# EAGLE design Mainboard (EAGLE 6.3)

## Sheet 1 of 2
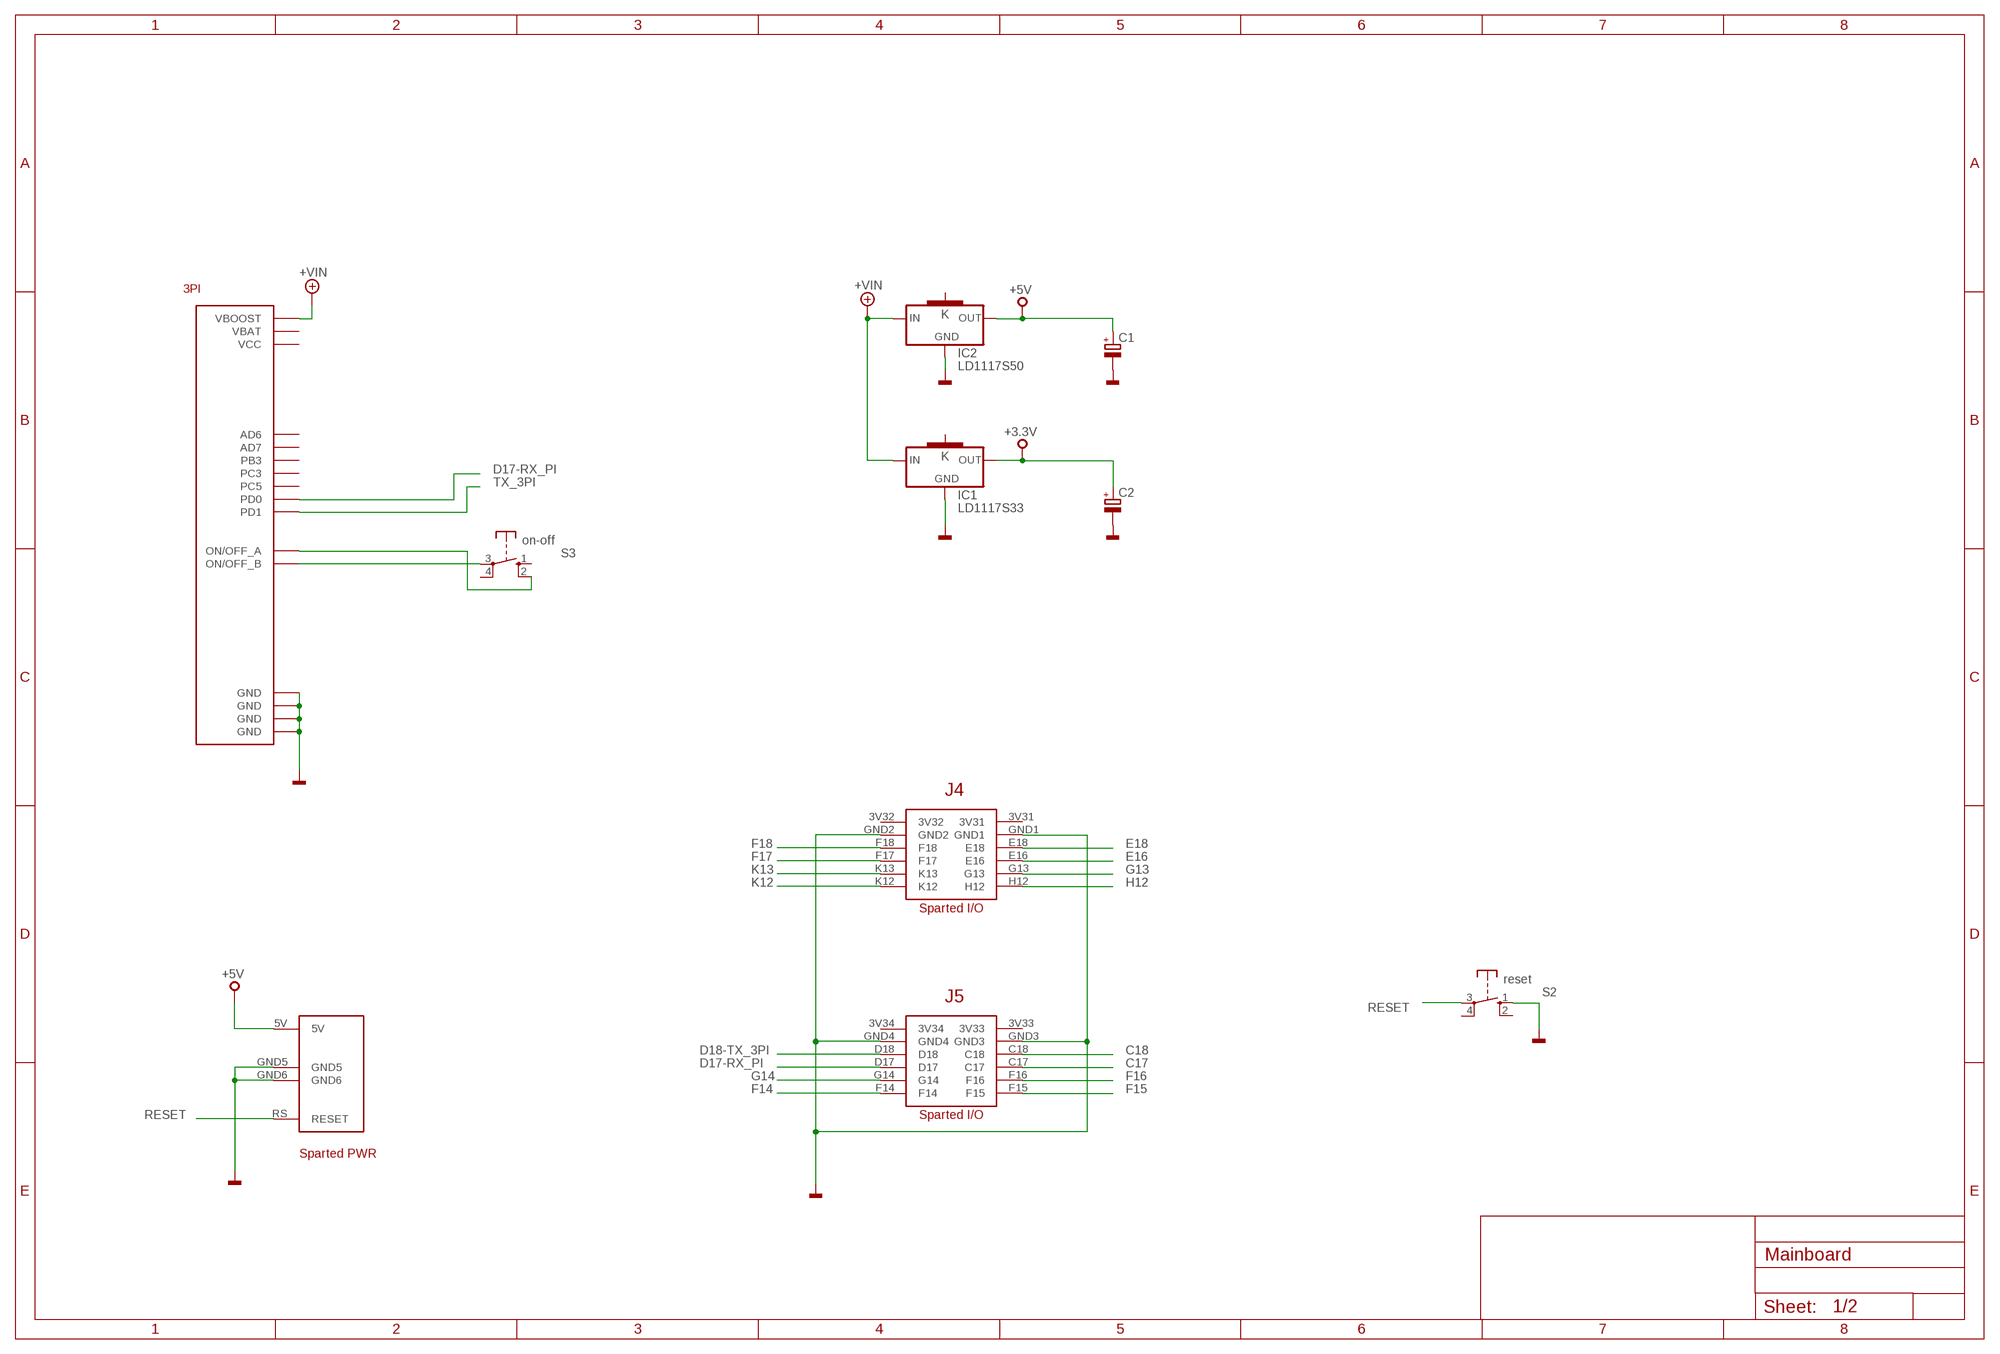
[diagram p0: schematic, sheet 1]

### Parts
C1  CPOL-EUE2.5-5  [E2,5-5]
C2  CPOL-EUE2.5-5  [E2,5-5]
IC1  LD1117S33  [SOT223]
IC2  LD1117S50  [SOT223]
S2  reset  DT6  [DT6]
S3  on-off  DT6  [DT6]
U$1  M3PI-NO-LCD  [M3PI-NO-LCD]
U$4  LX9  [LX9]

### Nets
+3,3V: C2.+ IC1.2(OUT) ; supply symbol labelled +3.3V
+5V: C1.+ IC2.2(OUT) U$4.5V ; also sheet 2
+VIN: IC1.3(IN) IC2.3(IN) U$1.VBOOST
C17: U$4.C17 ; also sheet 2
C18: U$4.C18 ; also sheet 2
D17-RX_PI: U$1.PD0 U$4.D17 ; also sheet 2
D18-TX_3PI: U$4.D18 ; also sheet 2
E16: U$4.E16 ; also sheet 2
E18: U$4.E18 ; also sheet 2
F14: U$4.F14 ; also sheet 2
F15: U$4.F15 ; also sheet 2
F16: U$4.F16 ; also sheet 2
F17: U$4.F17 ; also sheet 2
F18: U$4.F18 ; also sheet 2
G13: U$4.G13 ; also sheet 2
G14: U$4.G14 ; also sheet 2
GND: C1.- C2.- IC1.1(GND) IC2.1(GND) S2.1(S) U$1.GND@1(GND) U$1.GND@2(GND) U$1.GND@3(GND) U$1.GND@4(GND) U$4.GND1 U$4.GND2 U$4.GND3 U$4.GND4 U$4.GND5 U$4.GND6 ; also sheet 2
H12: U$4.H12 ; also sheet 2
K12: U$4.K12 ; also sheet 2
K13: U$4.K13 ; also sheet 2
N$3: S3.3(P) U$1.ON/OFF_B
N$4: S3.2(S) U$1.ON/OFF_A
RESET: S2.3(P) U$4.RS(RESET)
TX_3PI: U$1.PD1 ; also sheet 2
Unconnected: IC1.4(K) IC2.4(K) S2.2(S) S2.4(P) S3.1(S) S3.4(P) U$1.AD6 U$1.AD7 U$1.PB3 U$1.PC3 U$1.PC5 U$1.VBAT U$1.VCC U$4.3V31 U$4.3V32 U$4.3V33 U$4.3V34

### Notes on the sheet
- Sparted I/O
- Sparted I/O
- Sparted PWR

## Sheet 2 of 2
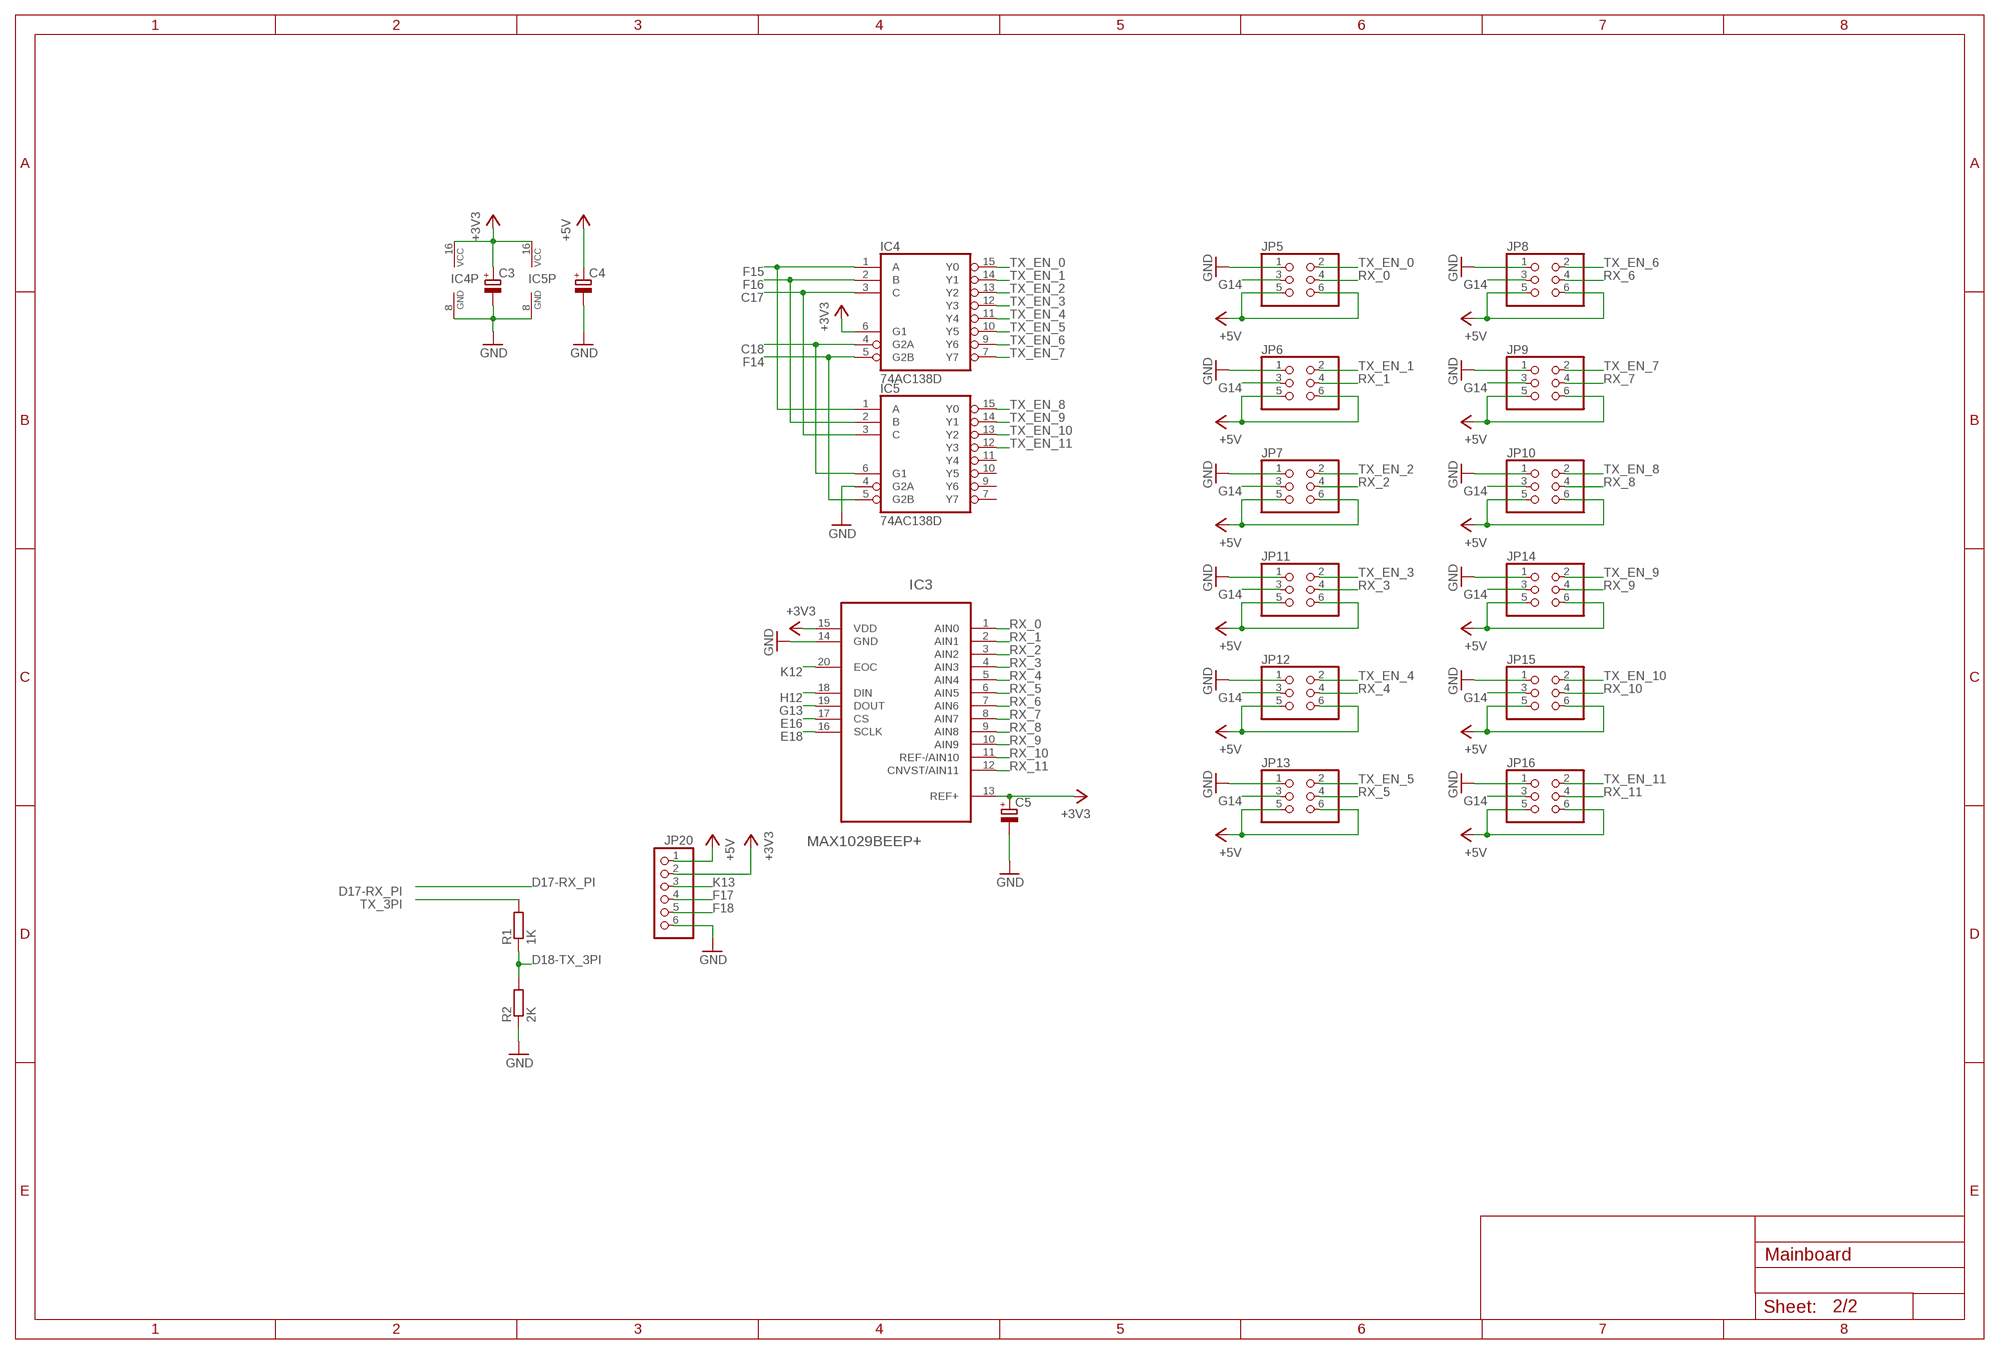
[diagram p1: schematic, sheet 2]

### Parts
C3  CPOL-EUE2-5  [E2-5]
C4  CPOL-EUE2-5  [E2-5]
C5  CPOL-EUE2-5  [E2-5]
IC3  MAX1029BEEP+  [SOP64P600X165-20N]
IC4  74AC138D  [SO16]
IC5  74AC138D  [SO16]
JP5  PINHD-2X3  [2X03]
JP6  PINHD-2X3/90  [2X03/90]
JP7  PINHD-2X3/90  [2X03/90]
JP8  PINHD-2X3/90  [2X03/90]
JP9  PINHD-2X3  [2X03]
JP10  PINHD-2X3/90  [2X03/90]
JP11  PINHD-2X3/90  [2X03/90]
JP12  PINHD-2X3/90  [2X03/90]
JP13  PINHD-2X3/90  [2X03/90]
JP14  PINHD-2X3/90  [2X03/90]
JP15  PINHD-2X3/90  [2X03/90]
JP16  PINHD-2X3/90  [2X03/90]
JP20  PINHD-1X6  [1X06]
R1  1K  R-EU_R0805  [R0805]
R2  2K  R-EU_R0805  [R0805]

### Nets
+3V3: C3.+ C5.+ IC3.13(REF+) IC3.15(VDD) IC4.6(G1) IC4.16(VCC) IC5.16(VCC) JP20.2
+5V: C4.+ JP5.5 JP5.6 JP6.5 JP6.6 JP7.5 JP7.6 JP8.5 JP8.6 JP9.5 JP9.6 JP10.5 JP10.6 JP11.5 JP11.6 JP12.5 JP12.6 JP13.5 JP13.6 JP14.5 JP14.6 JP15.5 JP15.6 JP16.5 JP16.6 JP20.1 ; also sheet 1
C17: IC4.3(C) IC5.3(C) ; also sheet 1
C18: IC4.4(G2A) IC5.6(G1) ; also sheet 1
D18-TX_3PI: R1.1 R2.2 ; also sheet 1
E16: IC3.17(CS) ; also sheet 1
E18: IC3.16(SCLK) ; also sheet 1
F14: IC4.5(G2B) IC5.5(G2B) ; also sheet 1
F15: IC4.1(A) IC5.1(A) ; also sheet 1
F16: IC4.2(B) IC5.2(B) ; also sheet 1
F17: JP20.4 ; also sheet 1
F18: JP20.5 ; also sheet 1
G13: IC3.19(DOUT) ; also sheet 1
G14: JP5.3 JP6.3 JP7.3 JP8.3 JP9.3 JP10.3 JP11.3 JP12.3 JP13.3 JP14.3 JP15.3 JP16.3 ; also sheet 1
GND: C3.- C4.- C5.- IC3.14(GND) IC4.8(GND) IC5.4(G2A) IC5.8(GND) JP5.1 JP6.1 JP7.1 JP8.1 JP9.1 JP10.1 JP11.1 JP12.1 JP13.1 JP14.1 JP15.1 JP16.1 JP20.6 R2.1 ; also sheet 1
H12: IC3.18(DIN) ; also sheet 1
K12: IC3.20(EOC) ; also sheet 1
K13: JP20.3 ; also sheet 1
RX_0: IC3.1(AIN0) JP5.4
RX_1: IC3.2(AIN1) JP6.4
RX_2: IC3.3(AIN2) JP7.4
RX_3: IC3.4(AIN3) JP11.4
RX_4: IC3.5(AIN4) JP12.4
RX_5: IC3.6(AIN5) JP13.4
RX_6: IC3.7(AIN6) JP8.4
RX_7: IC3.8(AIN7) JP9.4
RX_8: IC3.9(AIN8) JP10.4
RX_9: IC3.10(AIN9) JP14.4
RX_10: IC3.11(REF-/AIN10) JP15.4
RX_11: IC3.12(CNVST/AIN11) JP16.4
TX_3PI: R1.2 ; also sheet 1
TX_EN_0: IC4.15(Y0) JP5.2
TX_EN_1: IC4.14(Y1) JP6.2
TX_EN_2: IC4.13(Y2) JP7.2
TX_EN_3: IC4.12(Y3) JP11.2
TX_EN_4: IC4.11(Y4) JP12.2
TX_EN_5: IC4.10(Y5) JP13.2
TX_EN_6: IC4.9(Y6) JP8.2
TX_EN_7: IC4.7(Y7) JP9.2
TX_EN_8: IC5.15(Y0) JP10.2
TX_EN_9: IC5.14(Y1) JP14.2
TX_EN_10: IC5.13(Y2) JP15.2
TX_EN_11: IC5.12(Y3) JP16.2
Unconnected: IC5.7(Y7) IC5.9(Y6) IC5.10(Y5) IC5.11(Y4)

## Library data of the parts
C1-C5 = rcl:CPOL-EU: POLARIZED CAPACITOR, European symbol
IC1 = mbed-ics:LD1117S33: VOLTAGE REGULATOR SMD 3,3V
IC2 = mbed-ics:LD1117S50: VOLTAGE REGULATOR SMD 5V
IC3 = Ultrasound:MAX1029BEEP+; OC_FARNELL: 1714967
IC4 IC5 = 74xx-eu:74*138: 3-line to 8-line DECODER/DEMULTIPLEXER; OC_FARNELL: 1201320
JP5-JP16 = pinhead:PINHD-2X3: PIN HEADER
JP20 = pinhead:PINHD-1X6: PIN HEADER
R1 R2 = rcl:R-EU_: RESISTOR, European symbol
S2 S3 = switch-misc:DT: ITT SWITCH
U$1 = m3pi:M3PI-NO-LCD
U$4 = sparten6-lx9:LX9

## Board
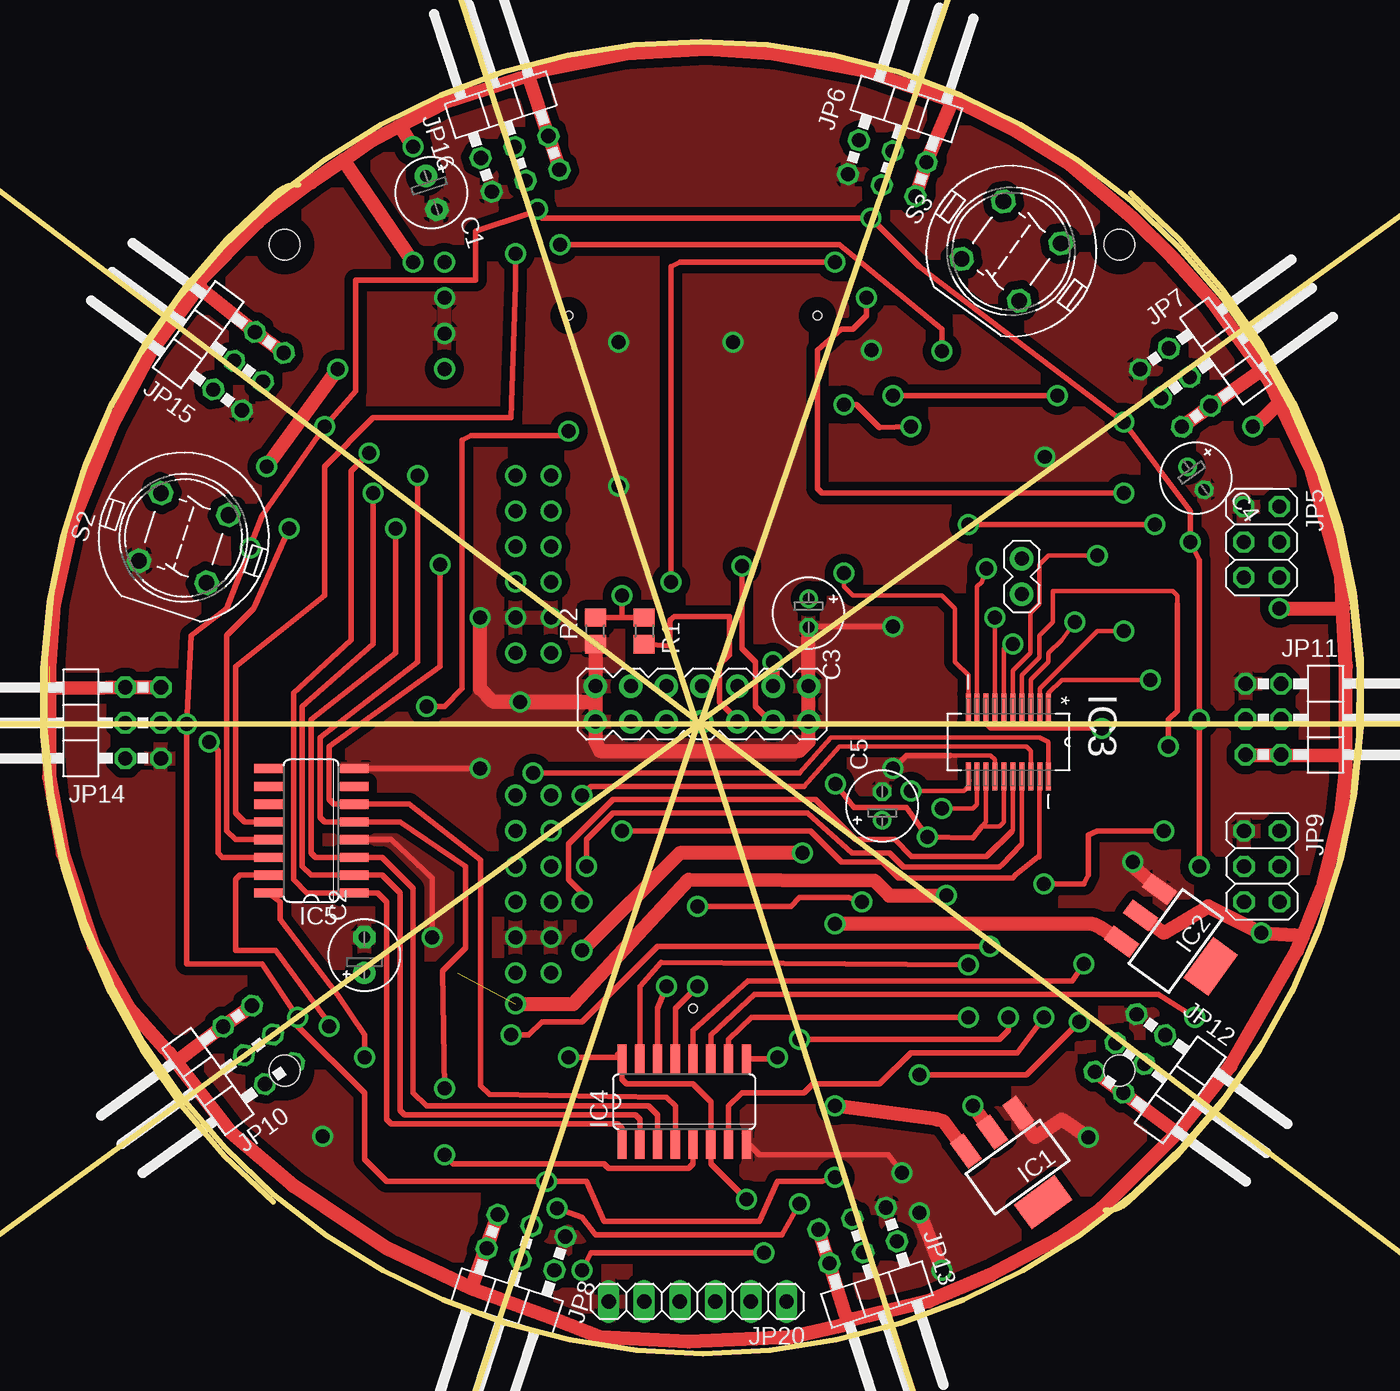
[diagram p2: board, top side]
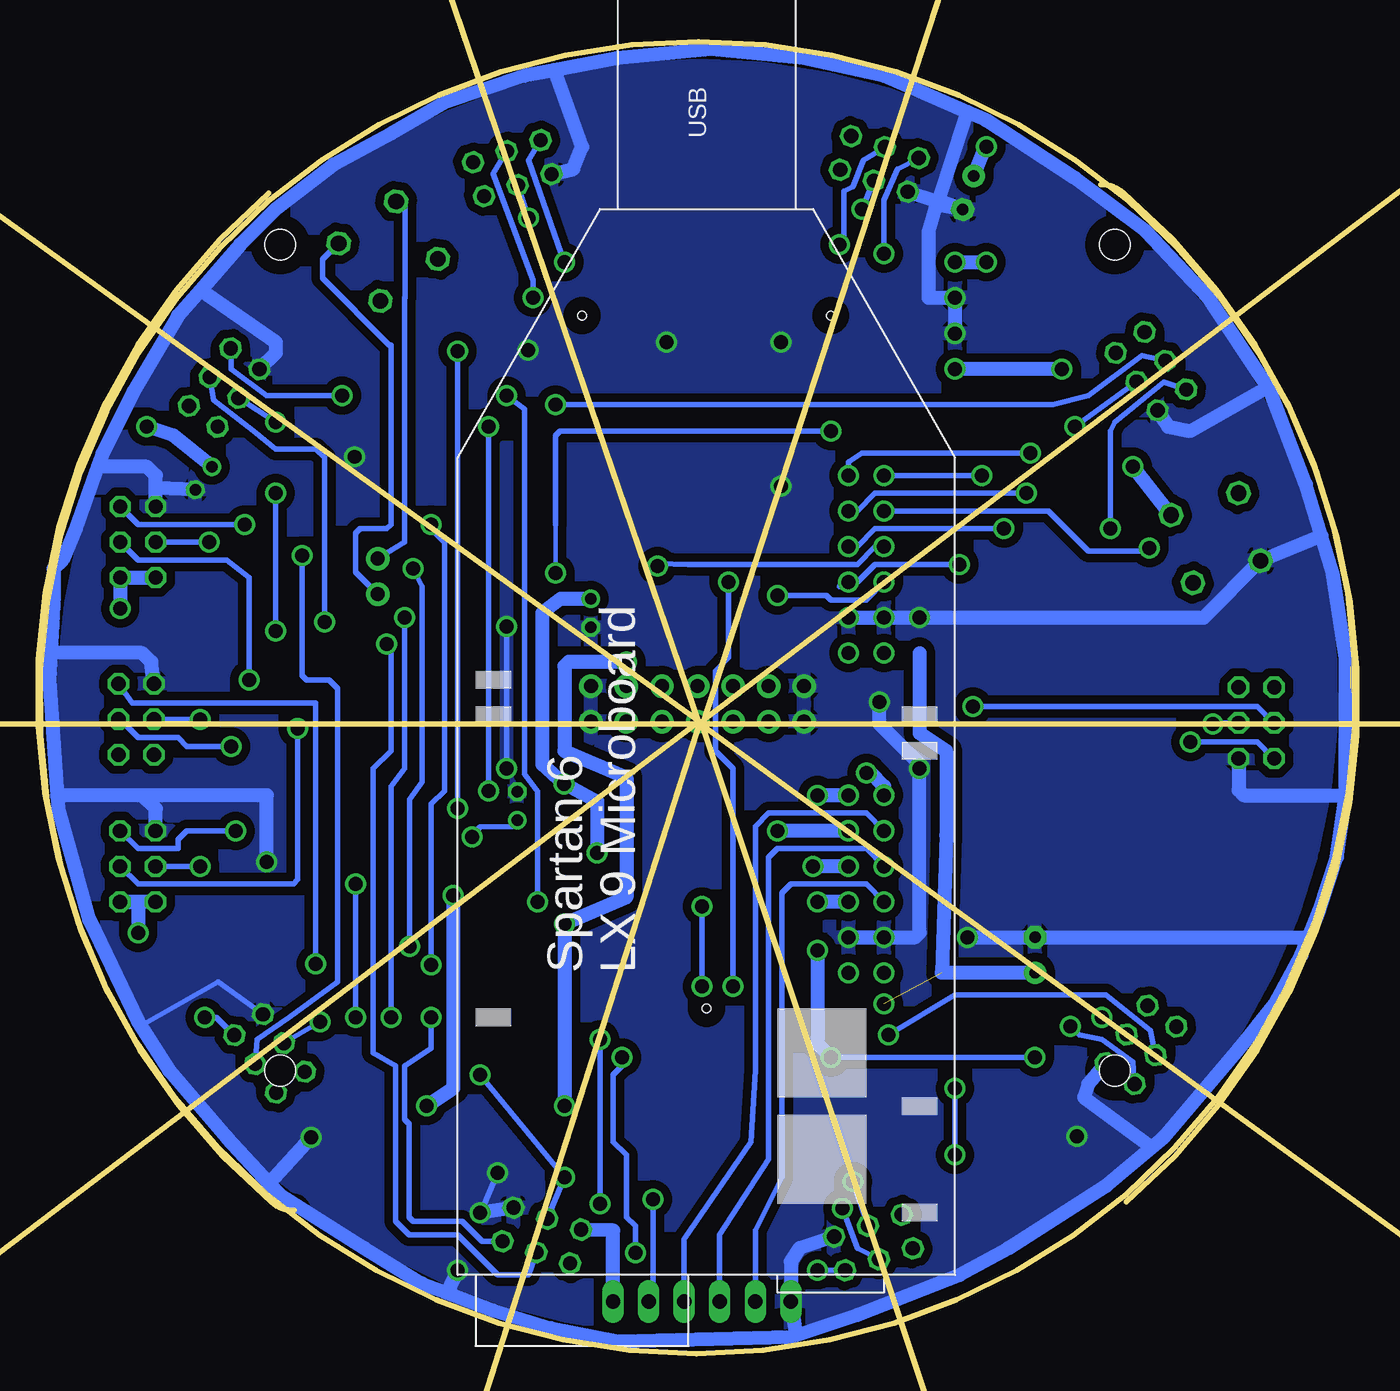
[diagram p3: board, bottom side, seen from below]

Size 94.28 x 93.8 mm. Coordinates in mm from the lower left corner, seen from the top.
Copper layers (1*16): Top 0.035mm / dielectric 1.5mm / Bottom 0.035mm
Design rules "default": minimum track width 10mil, minimum drill 24mil, track to track 8mil, track to pad 8mil, pad to pad 8mil, via to via 8mil, smd to smd 8mil, copper to edge 40mil, drill to drill 8mil, minimum pad ring 10mil, minimum via ring 8mil, stop-mask expansion 4mil, vias tented up to drill 0mil, thermal gap 10mil
Milling: 9 lines

### Footprints (pad centres in the part's own frame; a part is rotated, then mirrored left to right if it is on the bottom)
E2,5-5 = drill 0.813 pad 1.6: + -1.27,0 | drill 0.813 pad 1.6 octagon: - 1.27,0
E2-5 = drill 0.813 pad 1.27: + -1.016,0 | drill 0.813 pad 1.27 octagon: - 1.016,0
SOT223 = smd 1.219 x 2.235: 1 -2.311,-3.099; 2 0,-3.099; 3 2.311,-3.099 | smd 3.6 x 2.2: 4 0,3.099
SOP64P600X165-20N = smd 1.981 x 0.356: 1 -2.464,2.87; 2 -2.464,2.235; 3 -2.464,1.6; 4 -2.464,0.965; 5 -2.464,0.33; 6 -2.464,-0.33; 7 -2.464,-0.965; 8 -2.464,-1.6; 9 -2.464,-2.235; 10 -2.464,-2.87; 11 2.464,-2.87; 12 2.464,-2.235; 13 2.464,-1.6; 14 2.464,-0.965; 15 2.464,-0.33; 16 2.464,0.33; 17 2.464,0.965; 18 2.464,1.6; 19 2.464,2.235; 20 2.464,2.87
SO16 = smd 0.66 x 2.032: 1 -4.445,-3.073; 2 -3.175,-3.073; 3 -1.905,-3.073; 4 -0.635,-3.073; 5 0.635,-3.073; 6 1.905,-3.073; 7 3.175,-3.073; 8 4.445,-3.073; 9 4.445,3.073; 10 3.175,3.073; 11 1.905,3.073; 12 0.635,3.073; 13 -0.635,3.073; 14 -1.905,3.073; 15 -3.175,3.073; 16 -4.445,3.073
2X03 = drill 1.016 octagon: 1 -2.54,-1.27; 2 -2.54,1.27; 3 0,-1.27; 4 0,1.27; 5 2.54,-1.27; 6 2.54,1.27
2X03/90 = drill 1.016 octagon: 1 -2.54,-6.35; 2 -2.54,-3.81; 3 0,-6.35; 4 0,-3.81; 5 2.54,-6.35; 6 2.54,-3.81
1X06 = drill 1.016 long: 1 -6.35,0; 2 -3.81,0; 3 -1.27,0; 4 1.27,0; 5 3.81,0; 6 6.35,0
R0805 = smd 1.3 x 1.5: 1 -0.95,0; 2 0.95,0
DT6 = drill 1.118 octagon: 1 -2.54,2.54; 2 2.54,2.54; 3 2.54,-2.54; 4 -2.54,-2.54
M3PI-NO-LCD = drill 1 pad 1.676: AD6 0,-16.97; AD7 -2.54,-16.97; GND@1 -7.62,-14.43; GND@2 -7.62,-16.97; GND@3 7.62,-14.43; GND@4 7.62,-16.97; ON/OFF_A 22.86,-5.31; ON/OFF_B 22.86,-7.85; PB3 -5.08,-14.43; PC3 -2.54,-14.43; PC5 -5.08,-16.97; PD0 5.08,-16.97; PD1 2.54,-16.97; VBAT 2.54,-14.43; VBOOST 5.08,-14.43; VCC 0,-14.43 | hole 2.2: -29.845,-41.91; 29.845,-41.91; 29.845,17.145; -29.845,17.145
LX9 = drill 1: 3V31 21.59,-10.16; 3V32 21.59,-12.7; 3V33 44.45,-10.16; 3V34 44.45,-12.7; C17 52.07,-10.16; C18 49.53,-10.16; D17 52.07,-12.7; D18 49.53,-12.7; E16 29.21,-10.16; E18 26.67,-10.16; F14 57.15,-12.7; F15 57.15,-10.16; F16 54.61,-10.16; F17 29.21,-12.7; F18 26.67,-12.7; G13 31.75,-10.16; G14 54.61,-12.7; GND1 24.13,-10.16; GND2 24.13,-12.7; GND3 46.99,-10.16; GND4 46.99,-12.7; H12 34.29,-10.16; K12 34.29,-12.7; K13 31.75,-12.7 | drill 1 pad 1.27: 5V 72.39,-17.78; GND5 69.85,-17.78; GND6 67.31,-17.78; RS 64.77,-17.78 | hole 0.6: 19.05,0; 68.58,8.89; 68.58,-8.89

### Placement (x,y rotation side)
C1  27.79,83 288 top
C2  23.01,28.49 90 top
C3  54.76,52.93 270 top
C4  82.45,62.59 306 top
C5  60.03,39.16 90 top
IC1  69.7,13.32 216 top
IC2  81.01,29.5 234 top
IC3  69.05,43.73 270 top
IC4  45.87,18.01 0 top
IC5  19.2,37.38 90 top
JP5  87.15,58.01 270 top
JP6  61.96,89.58 342 top
JP7  85.1,72.05 306 top
JP8  32.99,3.11 162 top
JP9  87.16,34.83 270 top
JP10  11.32,19.08 126 top
JP11  92.36,45.35 270 top
JP12  81.85,18.47 234 top
JP13  59.84,3.61 198 top
JP14  2.1,45.09 90 top
JP15  10.61,73.22 54 top
JP16  32.57,89.89 18 top
JP20  46.82,3.72 180 top
R1  43.01,51.66 270 top
R2  39.52,51.66 90 top
S2  10.09,58.32 72 top
S3  69.25,78.82 54 top
U$1  47.14,62.14 0 top
U$4  46.51,5.63 90 bottom

### Tracks (layer width: path | path; a pad name or v marks a point on that pad's centre or on a via)
+3,3V  (via drill 1 pad 1.27)  (1 unrouted)
  Top 1.016: IC1.2 v66.51,17.69 | v64.6,32.74 60.54,32.74 59.46,33.82 46.19,33.88 37.93,24.99 v33.81,24.99
  Bottom 1.016: v66.51,17.69 64.6,18.96 v64.6,32.74 | C2.+ 29.68,27.22 29.36,37.06 29.36,43.09 31.27,44.36 31.27,50.08
+3V3  (via drill 1, 1 pad 1.27)
  Top 0.305: IC3.15 68.72,38 68.41,37.69 67.14,37.69 67.45,38 IC3.13
  Top 0.406: IC5.16 16.98,32.3 16.98,31.03 21.11,25.63 23.01,22.77 v23.01,21.19 | 41.32,21.19 IC4.16 | v37.62,21.19 41.11,21.19 41.11,21.4 IC4.16 | IC4.16 41.43,19.6 41.74,19.28 46.51,19.28 47.78,18.01 IC4.6 47.78,13.56 v50.32,11.03 | 67.14,37.69 66.51,36.87 v63.27,36.93 61.75,39.03 58,39.03 v56.69,40.72
  Top 1.016: v54.32,35.79 45.55,35.79 v38.57,28.8
  Bottom 0.406: v23.01,21.19 v37.62,21.19 | v50.32,11.03 50.32,4.04 JP20.2 | v56.69,40.72 57.16,41.29 56.55,40.68 | C5.+ 60.03,38.08 60.41,37.69 62.7,37.63 63.27,37.06 v63.27,36.93
  Bottom 1.016: C3.+ 56.92,53.95 58.25,52.94 58.25,42.14 v56.69,40.72 56.55,40.68 54.32,39.47 v54.32,35.79 | v38.57,28.8 38.57,22.14 v37.62,21.19
+5V  (via drill 1 pad 1.27)  (1 unrouted)
  Top 1.016: JP8.6 JP8.5 30.63,4.68 | 30.63,4.68 24.6,7.53 17.93,11.98 13.49,15.79 9.55,20.84 | 9.55,20.84 9.04,21.5 | 9.55,20.84 JP10.6 JP10.5 | 30.63,4.68 36.66,2.45 39.84,1.18 46.19,0.87 53.49,1.18 57.62,2.14 57.56,2.33 | 57.56,2.33 JP13.6 JP13.5 | 81.11,15.79 JP12.6 JP12.5 81.11,15.79 | 81.11,15.79 75.72,10.39 72.54,8.17 67.78,5.63 63.33,3.72 57.56,2.33 | 81.11,15.79 84.92,20.55 89.69,28.8 90.12,29.9 | 90.12,29.9 91.02,32.14 91.44,33.18 91.59,33.57 92.86,38.65 93.18,41.51 93.18,42.77 | 93.18,42.77 93.18,49.12 92.97,53.27 | JP11.5 JP11.6 93.18,42.77 | 92.97,53.27 92.86,55.47 90.64,63.41 88.45,68.03 | 88.45,68.03 87.78,69.44 87.15,70.31 | 87.15,70.31 83.65,75.16 80.8,78.33 77.94,81.19 73.49,85 69.37,87.54 66.19,89.13 65.06,89.52 | JP7.5 JP7.6 87.15,70.31 | 65.06,89.52 58.89,91.67 52.22,92.94 47.46,93.26 41.74,92.94 35.39,91.67 34.76,91.35 | JP16.5 JP16.6 34.76,91.35 | 34.76,91.35 28.73,89.45 25.57,87.78 | 25.57,87.78 23.33,86.59 21.51,85.33 | 21.51,85.33 19.2,83.73 15.39,80.88 10.95,76.43 | 10.95,76.43 JP15.6 JP15.5 | v26.5,86.27 25.57,87.78 | JP14.6 JP14.5 0.47,47.54 | 11.26,76.43 11.15,76.28 | 11.15,76.28 7.77,71.67 4.91,66.27 2.06,59.29 0.79,53.57 0.47,49.12 0.47,41.19 1.42,35.79 3.64,29.12 6.18,24.68 8.72,21.82 | 10.95,76.43 11.15,76.28 | 90.12,29.9 v87.15,30.08 83.34,31.98 80.16,30.08 IC2.2 | v88.42,53.25 92.97,53.27 | JP6.5 JP6.6 65.06,89.52 | v26.5,78.02 21.51,85.33 | v86.51,66.27 87.33,66.91 88.45,68.03
  Bottom 1.016: JP20.1 53.17,8.8 JP13.5 | JP9.5 JP9.6 87.15,32.3 v87.15,30.08 | JP5.5 JP5.6 v88.42,53.25 | C1.+ 26.82,85.64 v26.5,86.27 | U$4.5V v26.5,78.02 | C4.+ 84.6,65.63 v86.51,66.27
+VIN  (via drill 1 pad 1.27)
  Top 1.016: U$1.VBOOST v52.22,49.44 | IC1.3 64.43,16.6 63.97,16.74 v56.67,17.69 | IC2.3 75.72,30.39 75.08,30.71 v56.67,30.71
  Bottom 1.016: v52.22,49.44 56.35,49.44 56.67,49.12 56.67,43.09 52.22,41.19 52.22,32.62 v56.67,30.71 v56.67,17.69
C17  (via drill 1 pad 1.27)
  Top 0.406: IC4.3 43.97,17.06 43.33,17.69 27.46,17.69 26.5,18.65 26.5,33.25 24.28,35.47 IC5.3 19.52,35.47 19.2,35.79 19.2,45.32 25.23,50.08 v25.23,58.97
  Bottom 0.406: v25.23,58.97 34.44,58.97 35.71,57.7 U$4.C17
C18  (via drill 1 pad 1.27)
  Top 0.406: IC4.4 45.24,17.69 44.6,18.33 31.96,18.52 31.33,19.15 31.33,35.28 26.19,39.28 IC5.6 20.79,39.28 20.47,39.6 20.47,43.41 28.41,49.12 v28.41,56.43
  Bottom 0.406: v28.41,56.43 34.44,56.43 35.71,55.16 U$4.C18 | U$4.C18 36.66,55.16 36.98,54.84 36.66,54.84 U$4.C18
D17-RX_PI  (via drill 1 pad 1.27)
  Top 0.406: U$1.PD0 52.05,45.17 50.95,46.27 50.95,49.44 50,50.4 v50,56.3
  Bottom 0.406: v50,56.3 50,56.49 47.78,56.43 35.71,56.43 34.44,57.7 U$4.D17
D18-TX_3PI  (via drill 1 pad 1.27)
  Top 0.406: R1.1 R2.2 41.42,52.62 41.43,52.62 v41.43,54.2
  Bottom 0.406: v41.43,54.2 37.93,54.2 37.62,53.89 35.08,53.89 U$4.D18
E16  (via drill 1 pad 1.27)
  Top 0.305: IC3.17 70.01,36.44 69.94,36.36
  Top 0.406: v38.89,34.84 38.89,36.74 40.79,38.65 54.7,38.65 57.87,35.79 60.54,35.79 61.55,34.77 68.41,34.77 68.6,34.96 69.94,36.36
  Bottom 1.016: U$4.E16 v38.89,34.84
E18  (via drill 1 pad 1.27)
  Top 0.305: IC3.16 69.38,37.39 69.3,37.31
  Top 0.406: v38.57,32.3 38.57,32.93 37.62,33.88 37.62,36.43 40.79,39.6 55.27,39.6 58.13,36.74 60.92,36.74 62.13,35.54 67.46,35.54 69.3,37.31
  Bottom 1.016: U$4.E18 v38.57,32.3
F14  (via drill 1 pad 1.27)
  Top 0.406: v28.73,18.96 28.6,27.34 30.25,29 30.25,34.84 25.55,38.01 IC5.5 20.15,38.01 19.84,38.33 19.84,44.05 26.82,49.44 v26.82,62.78 | v28.73,14.2 29.36,13.56 40.16,13.56 40.47,13.25 46.19,13.25 46.51,13.56 IC4.5
  Bottom 0.406: v28.73,18.96 v28.73,14.2 | v26.82,62.78 U$4.F14
F15  (via drill 1 pad 1.27)
  Top 0.406: IC4.1 41.43,16.1 41.11,16.42 24.92,16.42 24.6,16.74 24.6,32.3 23.96,32.93 IC5.1 18.88,32.93 17.93,33.88 17.93,47.22 22.06,51.03 22.06,63.09 v23.33,64.37
  Bottom 0.406: v23.33,64.37 35.39,64.37 36.35,63.73 U$4.F15
F16  (via drill 1 pad 1.27)
  Top 0.406: IC4.2 42.7,16.74 42.38,17.06 25.87,17.06 25.55,17.37 25.55,32.93 24.28,34.2 IC5.2 19.2,34.2 18.57,34.84 18.57,46.27 23.65,50.71 v23.65,61.51
  Bottom 0.406: v23.65,61.51 34.44,61.51 35.71,60.24 U$4.F16
F17
  Bottom 0.406: U$4.F17 35.08,36.11 41.43,36.11 42.06,35.47 42.06,13.88 45.55,8.48 JP20.4
F18
  Bottom 0.406: U$4.F18 35.08,33.57 40.47,33.57 41.11,32.93 41.11,12.61 43.01,8.8 JP20.5
G13  (via drill 1 pad 1.27)
  Top 0.305: 71.21,35.54 71.27,35.47 71.27,39.66 IC3.19
  Top 0.406: v41.43,37.38 54.89,37.38 57.11,35.15 60.03,35.15 61.17,34.01 69.37,34.01 69.56,34.2 71.21,35.54
  Bottom 1.016: U$4.G13 v41.43,37.38
G14  (via drill 1 pad 1.27)
  Top 0.406: 15.1,58.32 15.71,59.92 v20.15,66.27 22.38,68.81 22.38,76.75 30.95,76.75 30.95,80.24 34.76,81.51 v35.39,81.83 35.71,81.19 v59.21,81.19 62.7,77.7 v77.3,66.59 82.07,60.24 v82.07,58.01 82.7,56.75 v82.7,45.32 v82.7,34.84 | 15.1,58.32 v14.82,57.6 | v14.82,57.6 13.17,53.25 10.63,51.35 v10.31,45 10.31,27.85 15.71,27.85 v18.25,24.04 18.25,23.41 23.01,18.65 23.01,13.88 24.6,12.3 v36.03,12.3 38.89,12.3 40.16,9.44 51.27,9.44 52.54,12.3 55.71,12.3 v56.67,12.61 | v74.13,23.72 70.32,19.92 v62.7,19.92 | v14.82,57.6 14.82,58.05 15.1,58.32
  Bottom 0.406: JP14.3 10.22,45.09 v10.31,45 | JP15.3 v20.15,66.27 | JP16.3 v35.39,81.83 | JP6.3 v59.21,81.19 | JP9.3 v82.7,34.84 | JP11.3 v82.7,45.32 | JP5.3 v82.07,58.01 | JP12.3 v74.13,23.72 | JP8.3 v36.03,12.3 | JP13.3 v56.67,12.61 v62.7,19.92 | v18.25,24.04 JP10.3 | U$4.G14 22.06,60.24 19.2,57.38 15.04,57.38 v14.82,57.6 | JP7.3 78.26,67.22 v77.3,66.59 JP7.3
GND  (via drill 1 pad 1.27)
  Top 0.305: IC3.14 68.08,42.47 67.78,42.77 64.92,42.77
  Top 0.406: IC5.4 24.92,36.74 27.84,34.01 v27.84,29.76 | IC5.8 v31.27,41.82 | IC4.8 50.53,14.94 51.27,14.2 60.48,14.2 v61.43,12.93 | 64.92,42.77 61.75,42.77 v60.79,41.82 | v60.79,51.98 54.82,51.98 C3.-
  Top 1.016: 39.52,46.27 U$1.GND@2 39.52,43.73 39.84,43.09 54.13,43.09 54.76,43.73 U$1.GND@4 U$1.GND@3 C3.- | 39.52,46.58 U$1.GND@1 R2.1 | 39.52,46.58 39.52,46.27 | v62.7,10.07 v64.29,5.94 | IC1.1 70.95,15.47 72.86,16.74 v74.76,15.47 | IC2.1 77.94,34.84 v77.94,35.15 | v34.12,46.58 39.2,46.58 39.52,46.27 | 39.52,46.58 v34.12,46.58 | v34.12,46.58 32.22,46.58 31.27,47.54 v31.27,52.62
  Bottom 0.406: v61.43,12.93 62.7,9.94 JP13.1 | JP12.1 81.43,26.58 86.96,23.44 | v60.79,41.82 v60.79,51.98
  Bottom 1.016: U$4.GND3 U$4.GND4 v31.27,52.62 10.96,52.62 S2.1 2.54,58.47 | U$4.GND1 U$4.GND2 31.58,29.76 31.27,30.08 v31.27,41.82 31.27,42.14 34.12,45 v34.12,46.58 | JP14.1 8.45,40.28 8.09,39.92 0.79,39.92 | 0.79,39.92 0.79,49.76 1.74,55.79 2.54,58.47 | 2.54,58.47 3.64,62.14 6.18,68.81 6.38,69.1 | 6.38,69.1 10.63,75.48 15.07,80.24 20.15,84.05 26.5,88.18 27.84,88.76 | 27.84,88.76 33.81,91.35 39.52,92.62 46.19,93.26 52.86,92.62 57.38,91.76 | 57.38,91.76 59.52,91.35 65.24,89.45 69.05,87.22 73.18,85 77.3,81.83 79.84,79.29 82.65,76.03 | 82.65,76.03 84.29,74.21 87.46,68.81 89.69,64.37 90.02,63.42 | 90.02,63.42 91.59,58.97 92.54,56.75 93.18,56.11 93.18,54.2 93.39,50.11 | 93.39,50.11 93.5,48.17 92.92,39.89 | 92.92,39.89 92.86,38.97 91.59,34.52 90.64,31.03 87.15,23.72 84.92,20.23 80.8,15.47 77.75,12.17 | 77.75,12.17 76.99,11.34 70.95,7.53 66.83,4.99 65.05,4.33 | 65.05,4.33 61.75,3.09 57.62,1.82 52.86,0.87 40.47,1.18 40.09,1.31 | 40.09,1.31 35.71,2.77 28.41,5.63 24.92,7.53 17.93,11.98 14.67,14.74 | 14.67,14.74 13.8,15.47 8.41,21.82 5.87,24.99 3.96,28.49 3.41,29.86 | 3.41,29.86 2.69,31.66 1.42,35.47 0.79,39.92 | JP10.1 19.2,19.28 19.52,18.33 14.67,14.74 | JP8.1 39.84,7.53 40.47,6.58 JP20.6 40.09,1.31 | JP13.1 v62.7,10.07 | v64.29,5.94 65.05,4.33 | JP9.1 85.88,38.97 86.83,39.92 | 86.83,39.92 92.23,39.92 92.92,39.89 | JP11.1 86.19,49.44 86.83,50.08 93.39,50.11 | JP5.1 85.88,62.14 | 90.02,63.42 86.51,63.41 85.88,62.78 85.88,62.14 | 82.65,76.03 77.3,72.3 77.3,71.54 JP7.1 | JP6.1 56.03,84.68 55.4,86.27 57.38,91.76 | JP16.1 C1.- | C1.- 30,82.15 27.84,88.76 | C1.- 30,82.46 30.63,80.24 30.63,75.48 U$4.GND5 U$4.GND6
  Bottom 1.016: JP15.1 13.49,66.27 11.9,65.95 6.38,69.1 | v74.76,15.47 77.75,12.17 | v77.94,35.15 77.94,39.92 86.83,39.92 | v27.84,29.76 C2.- 3.51,29.76 3.41,29.86 | C4.- 85.81,61.89 85.88,62.14
  other vias: 41.17,62.02 41.17,72.3 71.65,64.11 59.27,71.73 49.36,72.3 20.03,15.53
  pour Bottom (isolate 0.61): -10.64,95.16 95.27,95.16 95.27,-5.99 -14.84,-5.99 -14.84,95.54
  pour Top (isolate 0.61): -11.98,99.35 -15.03,101.26 -15.03,-2.18 94.7,-2.18 94.7,100.31 -8.74,100.31 -8.74,99.73
H12  (via drill 1 pad 1.27)
  Top 0.305: 54.44,40.55 56.98,43.41 70.32,43.41 70.65,43.08 IC3.18
  Top 0.406: v38.57,39.92 39.2,40.55 54.44,40.55
  Bottom 1.016: U$4.H12 v38.57,39.92
K12  (via drill 1 pad 1.27)
  Top 0.305: 54.13,41.51 56.35,44.05 71.27,44.05 71.92,43.71 IC3.20
  Top 0.406: v35.08,41.51 54.13,41.51
  Bottom 1.016: U$4.K12 33.81,40.55 34.76,41.51 v35.08,41.51
K13
  Bottom 0.406: U$4.K13 35.08,38.65 42.06,38.65 43.01,37.69 43.01,20.23 43.33,15.15 48.09,8.17 JP20.3
N$3
  Bottom 0.406: U$1.ON/OFF_B 71.59,55.88 71.59,58.65 71.27,58.97 69.37,58.97 69.05,59.29 69.05,72.11 69.17,72.11 73.94,76.87 73.94,78.24 S3.3
N$4
  Bottom 0.406: U$1.ON/OFF_A 68.1,58.01 68.1,75.48 68.03,75.48 68.03,82.21 68.69,82.21 S3.2
RESET  (via drill 1 pad 1.27)
  Top 1.016: v16.03,63.41 v21.11,70.4
  Bottom 1.016: S2.3 v16.03,63.41 | v21.11,70.4 U$4.RS
RX_0  (via drill 1 pad 1.27)
  Top 0.305: IC3.1 71.92,47.23 72.86,48.17 v79.21,48.17
  Bottom 0.406: JP5.4 87.15,56.75 80.8,56.75 79.21,55.47 v79.21,48.17
RX_1  (via drill 1 pad 1.27)
  Top 0.305: IC3.2 71.28,47.55 75.4,51.66 v77.3,51.66
  Top 0.406: v77.3,61.51 55.71,61.51 55.4,61.83 55.4,71.73 57.11,73.26 57.94,73.26 58.89,74.21 v58.89,75.48
  Bottom 0.406: JP6.4 61.75,84.37 58.89,76.75 v58.89,75.48 | v77.3,51.66 v77.3,61.51
RX_2  (via drill 1 pad 1.27)
  Top 0.305: IC3.3 70.65,48.19 71.91,49.44 71.91,50.08 72.86,51.03 v73.81,52.3
  Bottom 0.305: v73.81,52.3 73.81,52.62
  Bottom 0.406: JP7.4 81.75,68.18 78.89,65.95 77.3,64.68 74.45,64.68 73.81,64.05 73.81,52.62
RX_3  (via drill 1 pad 1.27)
  Top 0.305: IC3.4 70.01,48.5 71.27,49.76 71.27,51.35 72.22,52.3 72.22,54.52 80.8,54.52 81.11,54.2 81.11,53.57
  Top 0.406: v80.48,43.41 80.48,45.32 81.11,45.95 81.11,53.57
  Bottom 0.406: JP11.4 88.45,45.35 87.15,44.05 84.29,44.05 83.65,43.41 v80.48,43.41
RX_4  (via drill 1 pad 1.27)
  Top 0.305: IC3.5 69.38,48.82 70.64,50.08 70.64,52.94 71.27,53.57 71.27,56.43 71.91,57.06 v75.4,57.06
  Bottom 0.406: JP12.4 78.64,22.46 76.35,24.04 72.86,26.58 72.86,47.54 73.49,48.17 75.08,48.17 75.4,48.49 v75.4,57.06
RX_5  (via drill 1 pad 1.27)
  Top 0.305: IC3.6 68.72,48.16 68.73,49.12 68.73,50.4 v69.37,50.71
  Bottom 0.406: JP13.4 59.21,5.63 61.43,5.63 64.29,8.48 67.78,8.48 68.73,9.44 68.73,20.55 70.32,21.5 70.32,41.82 69.05,43.09 69.05,50.4 v69.37,50.71
RX_6  (via drill 1 pad 1.27)
  Top 0.305: IC3.7 68.08,49.43 v68.1,52.62
  Top 0.406: v36.79,10.39 38.57,9.75 39.52,8.48 52.86,8.48 v54.13,10.71 | v54.13,22.46 68.41,22.46 69.05,23.09 v69.05,24.04
  Bottom 0.406: JP8.4 35.71,7.53 v36.79,10.39 | v54.13,10.71 v54.13,22.46 | v69.05,24.04 69.05,40.55 68.1,41.82 v68.1,52.62
RX_7  (via drill 1 pad 1.27)
  Top 0.305: IC3.8 67.45,45.01 67.78,44.68 v75.72,44.68
  Bottom 0.406: JP9.4 88.41,34.83 87.15,33.57 76.03,33.57 75.72,33.88 v75.72,44.68
RX_8  (via drill 1 pad 1.27)
  Top 0.305: IC3.9 66.81,54.83 67.14,55.16 v67.46,56.11
  Top 0.406: v33.49,22.77 34.76,22.77 35.71,23.72 38.57,23.72 43.97,29.12 v67.71,29.12
  Bottom 0.406: JP10.4 14.76,23.09 17.93,25.63 28.73,25.63 v33.49,22.77 | v67.71,29.12 67.71,39.6 66.83,40.87 66.83,54.84 v67.46,56.11
RX_9  (via drill 1 pad 1.27)
  Top 0.305: IC3.10 66.18,48.5 65.24,49.44 65.24,53.25 64.29,54.2 57.94,54.2 57.3,54.84 v57.3,55.79
  Top 0.406: v27.46,46.27 28.73,46.27 30,47.54 30,65.32 30.63,65.63 37.3,65.63 v37.62,65.95
  Bottom 0.305: v57.3,55.79 57.3,59.29
  Bottom 0.406: JP14.4 5.96,45.09 7.14,46.27 v27.46,46.27 | v37.62,65.95 56.98,65.95 57.3,65.63 57.3,59.29
RX_10  (via drill 1 pad 1.27)
  Top 0.305: 66.19,41.19 66.27,40.95 IC3.11 66.18,40.54 65.87,40.23 v62.06,40.23
  Top 0.406: v62.06,66.27 59.84,66.21 58.19,67.86 v57.3,67.86
  Bottom 0.406: JP15.4 15.39,71.35 19.2,68.49 21.74,67.86 v57.3,67.86 | v62.06,40.23 v62.06,66.27
RX_11  (via drill 1 pad 1.27)
  Top 0.305: IC3.12 66.81,39.27 66.51,38.97 v64.29,38.97
  Top 0.406: v36.98,79.29 56.98,79.29 64.29,73.26 v64.29,71.67
  Bottom 0.406: JP16.4 35.27,85.32 36.03,83.41 36.66,83.1 36.66,79.29 v36.98,79.29 | v64.29,38.97 v64.29,71.67
TX_3PI
  Top 0.406: U$1.PD1 49.68,45.63 49.36,45.63 48.41,46.58 48.41,49.25 49.11,49.95 49.11,52.68 45.17,52.68 44.85,52.43 44.85,50.59 R1.2
TX_EN_0  (via drill 1 pad 1.27)
  Top 0.406: IC4.15 42.7,26.26 44.22,27.98 v66.19,27.79 | v66.19,59.29 v79.53,59.29
  Bottom 0.406: JP5.2 87.15,59.29 v79.53,59.29 | v66.19,27.79 66.19,39.28 65.24,40.23 65.24,58.01 66.19,58.97 v66.19,59.29
TX_EN_1  (via drill 1 pad 1.27)
  Top 0.406: IC4.14 43.97,24.68 v44.6,26.26 | v44.92,55.16 44.92,77.7 45.55,78.02 v56.67,78.02
  Bottom 0.406: v44.6,26.26 44.6,41.82 45.87,43.09 45.87,48.81 44.92,49.76 v44.92,55.16 | JP6.2 59.21,85.32 56.86,78.58 v56.67,78.02
TX_EN_2  (via drill 1 pad 1.27)
  Top 0.406: IC4.13 45.24,24.68 v46.82,26.26 | v46.82,31.98 53.49,31.98 54.13,32.62 57.62,32.62 v58.57,32.3 | v72.54,68.49 v60.79,68.49
  Bottom 0.406: v46.82,26.26 v46.82,31.98 | v58.57,32.3 58.57,40.17 59.52,41.44 59.52,67.54 v60.79,68.49 | JP7.2 80.48,70.4 77.94,68.49 v72.54,68.49
TX_EN_3  (via drill 1 pad 1.27)
  Top 0.406: IC4.12 46.51,23.09 50.44,26.65 73.62,26.65 v74.45,27.85
  Bottom 0.406: v74.45,27.85 74.45,46.52 87.56,46.52 JP11.2
TX_EN_4  (via drill 1 pad 1.27)
  Top 0.406: IC4.11 47.78,22.77 50.89,25.69 79.78,25.69 v82.38,24.04
  Bottom 0.406: v82.38,24.04 81.54,24.04 JP12.2
TX_EN_5  (via drill 1 pad 1.27)
  Top 0.406: IC4.10 49.05,22.46 50.7,24.04 v66.19,24.04
  Bottom 0.406: JP13.2 62.55,8.02 63.97,9.44 67.46,9.44 67.78,9.75 67.78,16.42 68.1,16.74 68.1,20.55 66.19,21.82 v66.19,24.04
TX_EN_6  (via drill 1 pad 1.27)
  Top 0.406: v38.57,5.94 39.2,7.22 v51.59,7.22 | IC4.9 52.44,21.08 v52.54,21.19
  Bottom 0.406: JP8.2 v38.57,5.95 v38.57,5.94 | v51.59,7.22 51.59,9.12 52.22,9.75 52.22,14.2 53.17,15.15 53.17,19.92 52.54,20.55 v52.54,21.19
TX_EN_7  (via drill 1 pad 1.27)
  Top 0.406: IC4.7 49.05,17.69 50,18.65 54.44,18.65 55.08,19.28 59.84,19.28 62.06,21.5 69.68,21.5 v71.59,24.04 | v80.16,37.38 75.4,37.38 74.76,37.06 74.76,34.2 74.45,33.57 v71.59,33.57
  Bottom 0.406: v71.59,24.04 v71.59,33.57 | JP9.2 88.41,37.37 87.15,36.11 84.29,36.11 84.29,36.74 83.65,37.38 v80.16,37.38
TX_EN_8  (via drill 1 pad 1.27)
  Top 0.406: IC5.15 14.12,34.2 13.8,33.88 13.8,28.8 16.66,28.8 20.15,24.04 v20.47,23.41
  Bottom 0.406: JP10.2 16.03,20.87 18.25,22.46 19.84,22.77 v20.47,23.41
TX_EN_9  (via drill 1 pad 1.27)
  Top 0.406: IC5.14 12.85,35.47 12.53,35.79 12.53,43.09 v11.9,43.73
  Bottom 0.406: JP14.2 5.96,42.55 7.14,43.73 v11.9,43.73
TX_EN_10  (via drill 1 pad 1.27)
  Top 0.406: IC5.13 13.8,36.74 13.17,37.38 13.17,51.35 15.07,53.25 v17.61,58.97
  Bottom 0.406: JP15.2 13.8,69.44 17.3,66.59 17.61,65.95 v17.61,58.97
TX_EN_11  (via drill 1 pad 1.27)
  Top 0.406: IC5.12 14.44,38.01 13.8,38.65 13.8,49.12 20.15,54.2 20.15,63.41 23.65,66.91 33.49,66.91 33.81,76.43 v33.81,78.65
  Bottom 0.406: JP16.2 32.85,84.68 33.81,82.46 v33.81,78.65